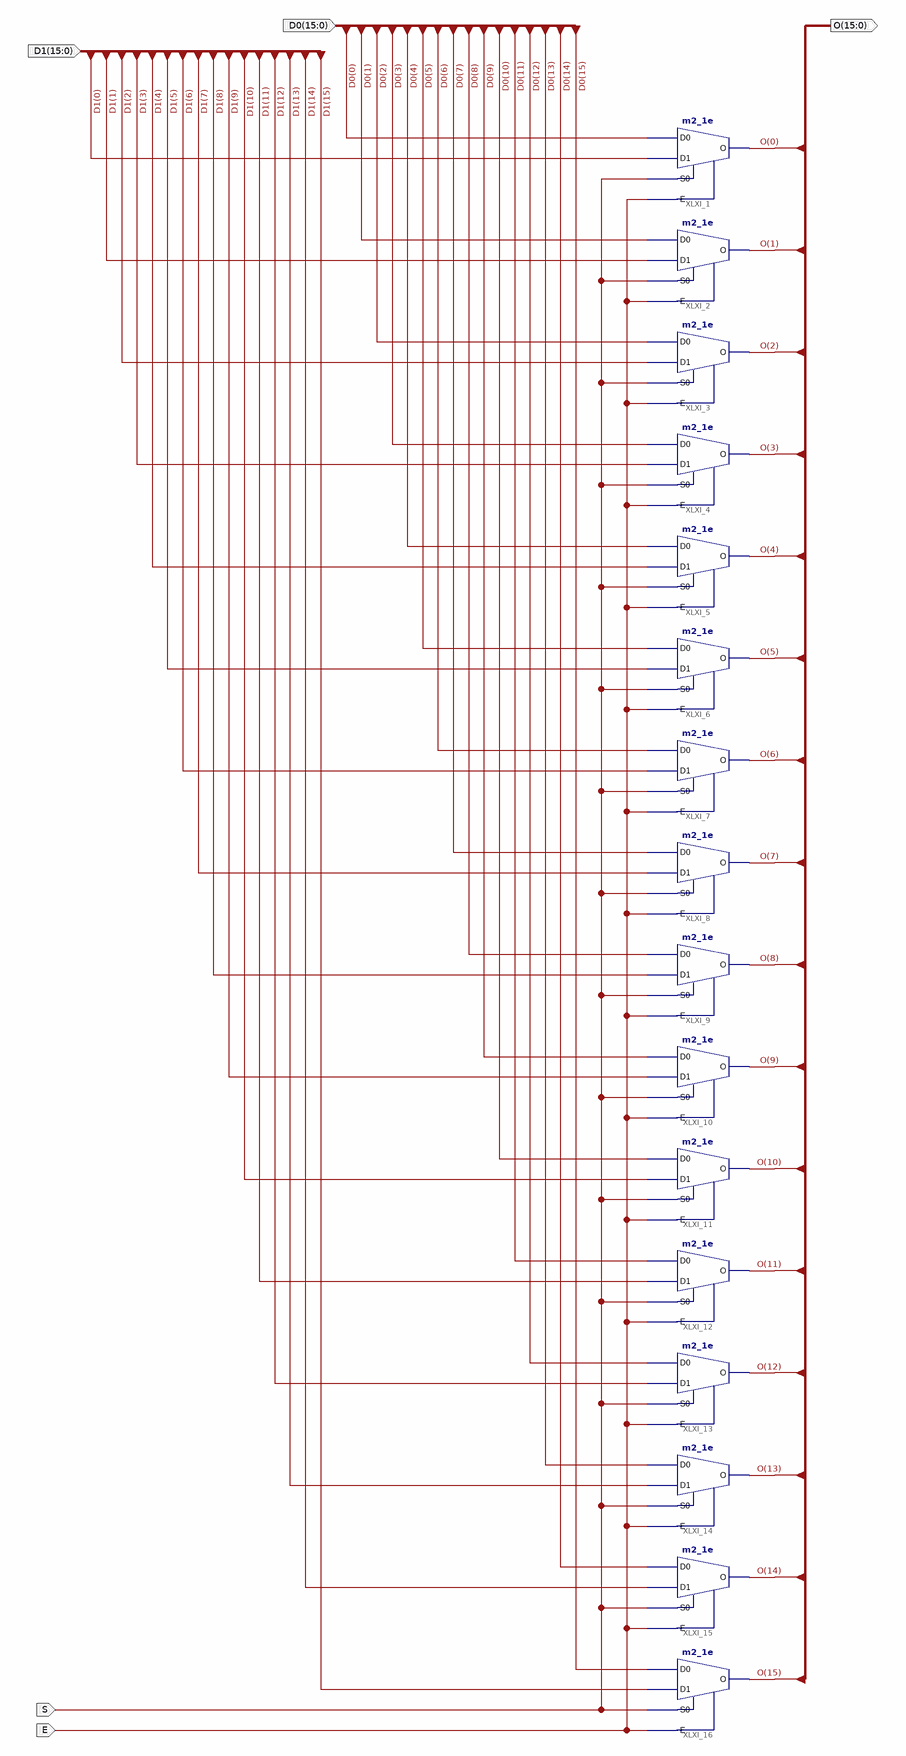
[diagram p0: schematic sheet 1]
// Xilinx ISE schematic mux2x1x16e.sch (spartan6) as structural Verilog: 16 symbols, 5 ports
module mux2x1x16e (
  input  [15:0] D1,
  input  [15:0] D0,
  input  S,
  input  E,
  output [15:0] O
);

  m2_1e XLXI_1 (.D0(D0[0]), .D1(D1[0]), .E(E), .S0(S), .O(O[0]));
  m2_1e XLXI_2 (.D0(D0[1]), .D1(D1[1]), .E(E), .S0(S), .O(O[1]));
  m2_1e XLXI_3 (.D0(D0[2]), .D1(D1[2]), .E(E), .S0(S), .O(O[2]));
  m2_1e XLXI_4 (.D0(D0[3]), .D1(D1[3]), .E(E), .S0(S), .O(O[3]));
  m2_1e XLXI_5 (.D0(D0[4]), .D1(D1[4]), .E(E), .S0(S), .O(O[4]));
  m2_1e XLXI_6 (.D0(D0[5]), .D1(D1[5]), .E(E), .S0(S), .O(O[5]));
  m2_1e XLXI_7 (.D0(D0[6]), .D1(D1[6]), .E(E), .S0(S), .O(O[6]));
  m2_1e XLXI_8 (.D0(D0[7]), .D1(D1[7]), .E(E), .S0(S), .O(O[7]));
  m2_1e XLXI_9 (.D0(D0[8]), .D1(D1[8]), .E(E), .S0(S), .O(O[8]));
  m2_1e XLXI_10 (.D0(D0[9]), .D1(D1[9]), .E(E), .S0(S), .O(O[9]));
  m2_1e XLXI_11 (.D0(D0[10]), .D1(D1[10]), .E(E), .S0(S), .O(O[10]));
  m2_1e XLXI_12 (.D0(D0[11]), .D1(D1[11]), .E(E), .S0(S), .O(O[11]));
  m2_1e XLXI_13 (.D0(D0[12]), .D1(D1[12]), .E(E), .S0(S), .O(O[12]));
  m2_1e XLXI_14 (.D0(D0[13]), .D1(D1[13]), .E(E), .S0(S), .O(O[13]));
  m2_1e XLXI_15 (.D0(D0[14]), .D1(D1[14]), .E(E), .S0(S), .O(O[14]));
  m2_1e XLXI_16 (.D0(D0[15]), .D1(D1[15]), .E(E), .S0(S), .O(O[15]));
endmodule
